# Altium schematic sheet Drawing.SchDoc
size A4; Author: Mikołaj Pichita; CompanyName: AGH University of Science and Technology; SheetNumber: 16; SheetTotal: 16
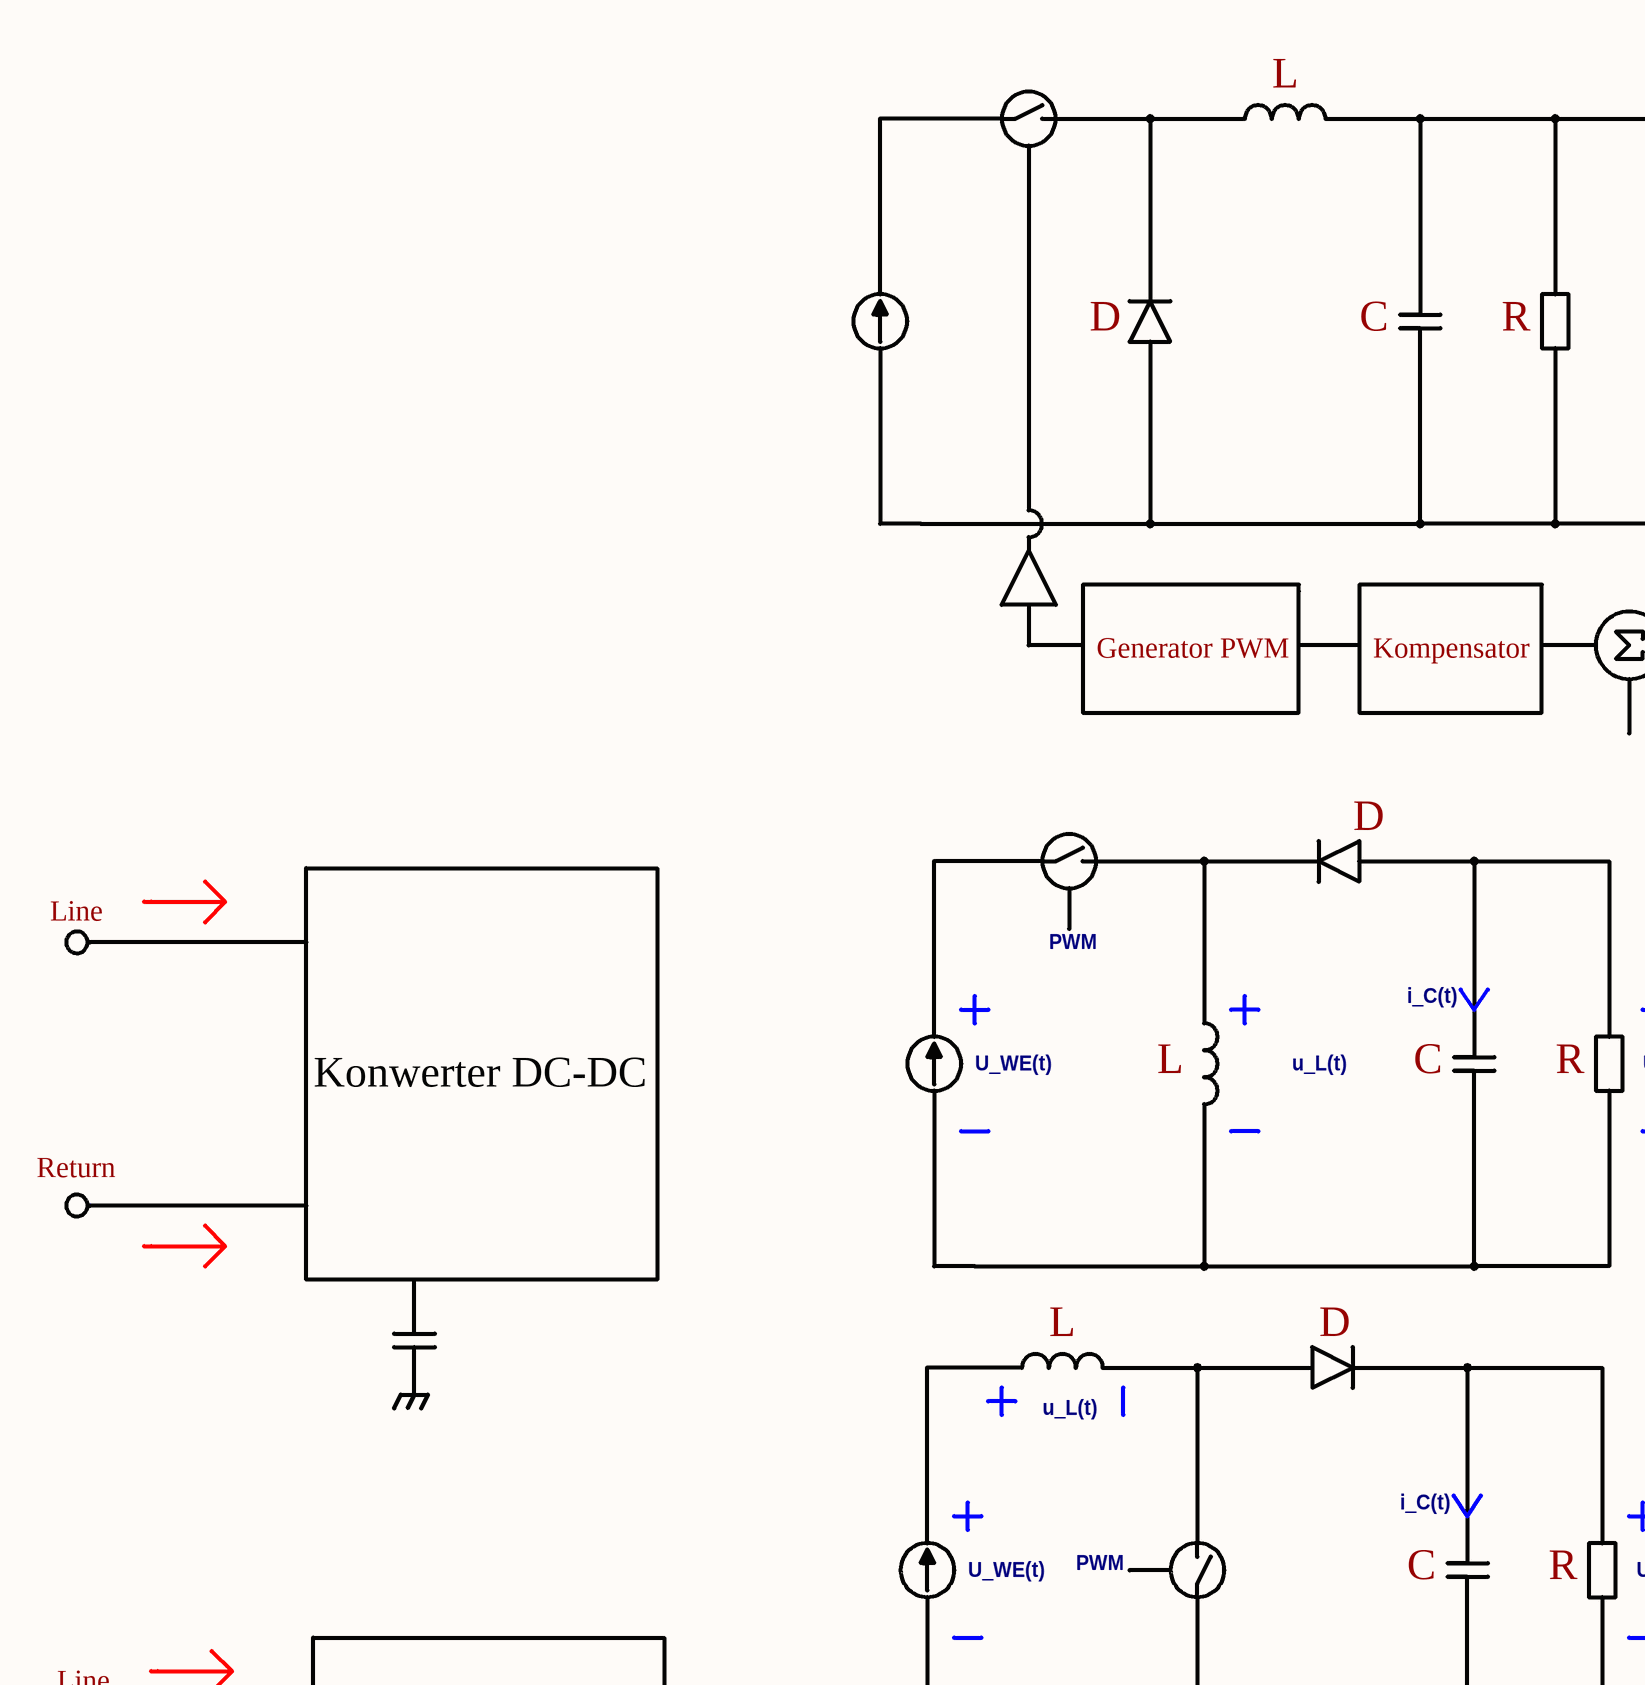
[diagram p0: Drawing.SchDoc, top left]
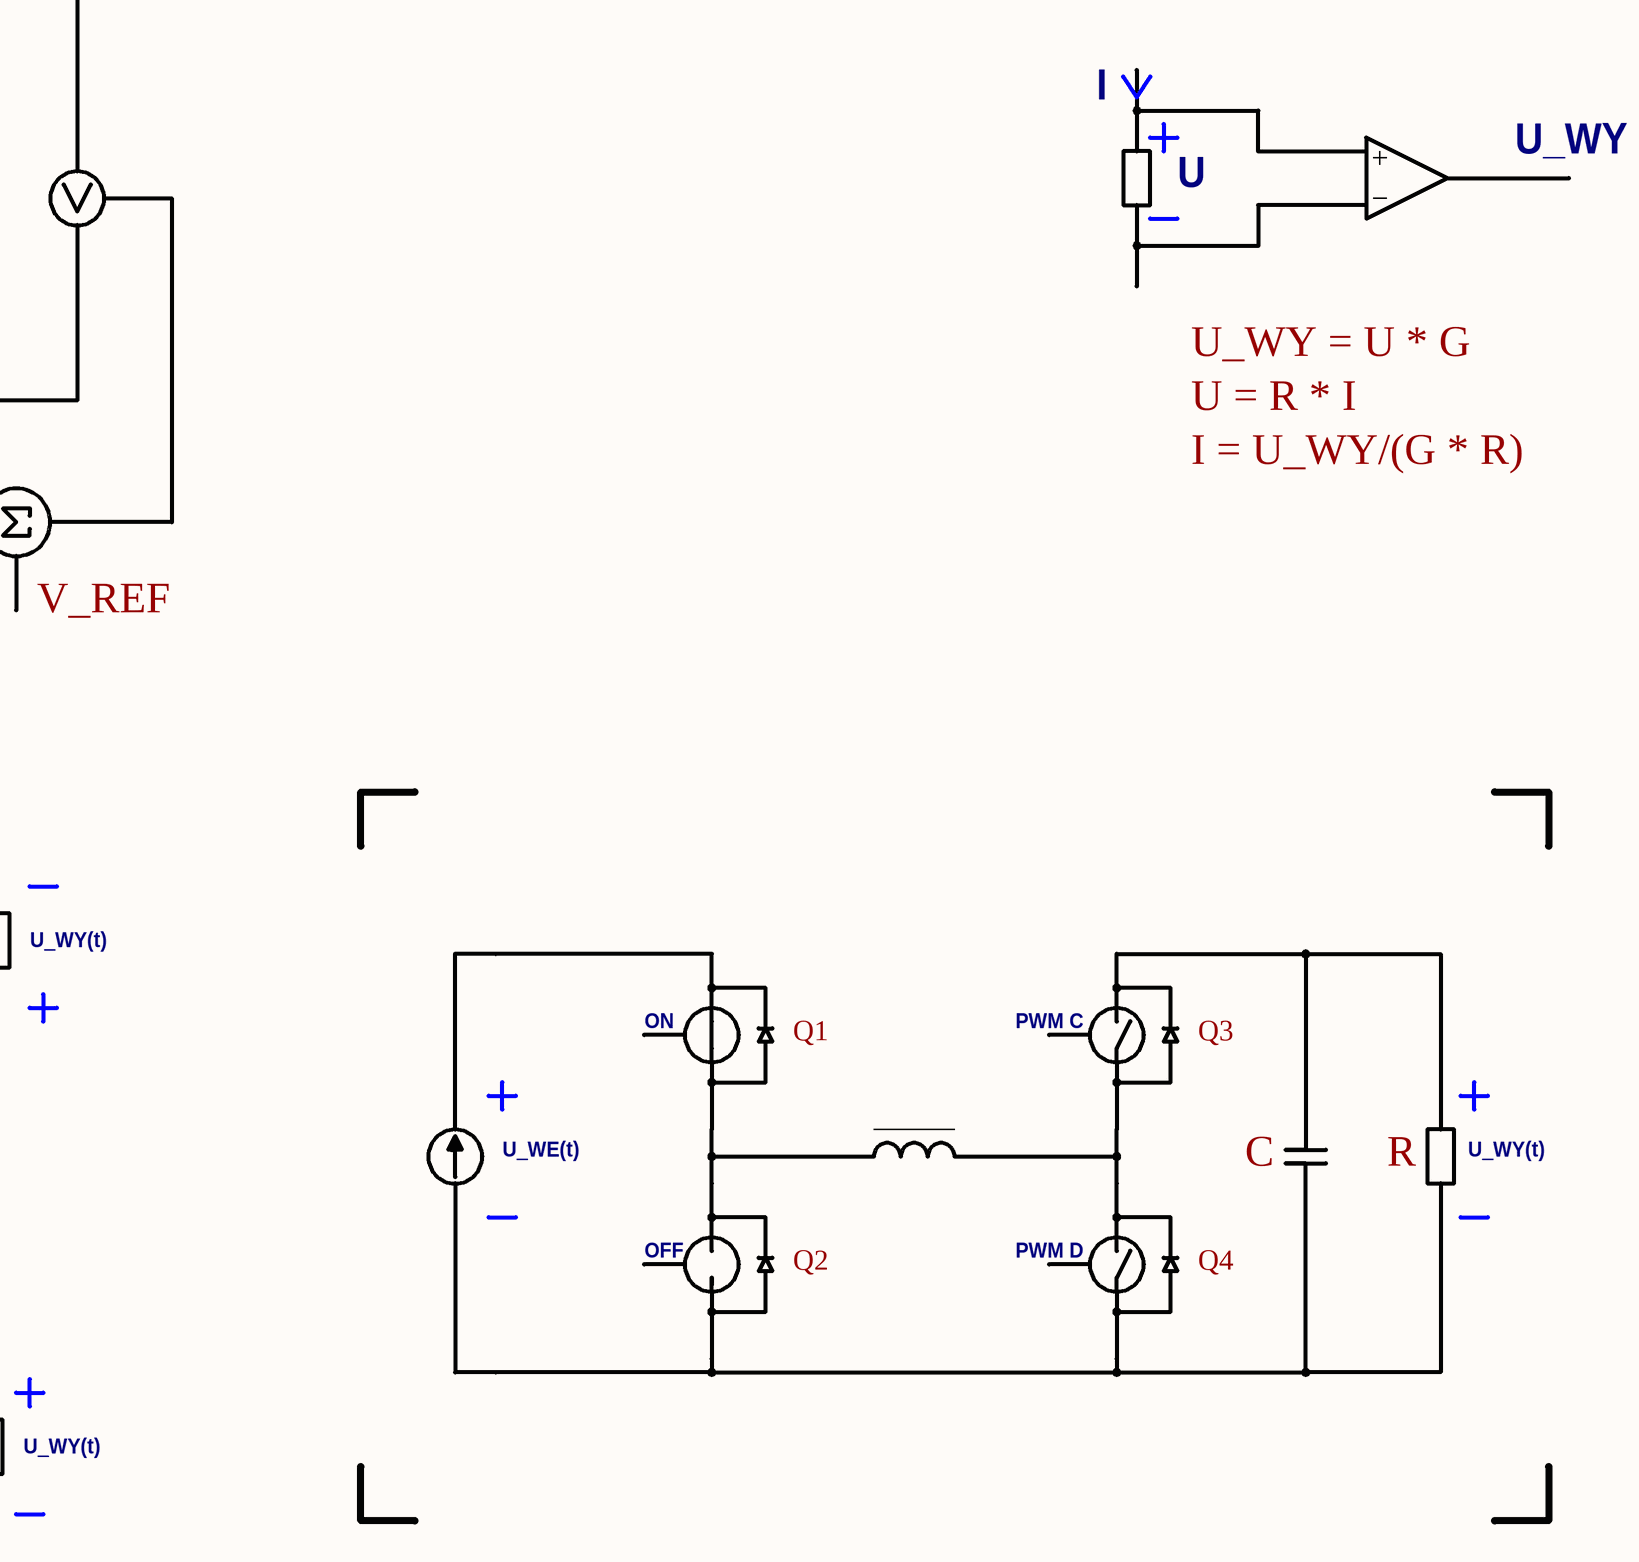
[diagram p1: Drawing.SchDoc, top middle]
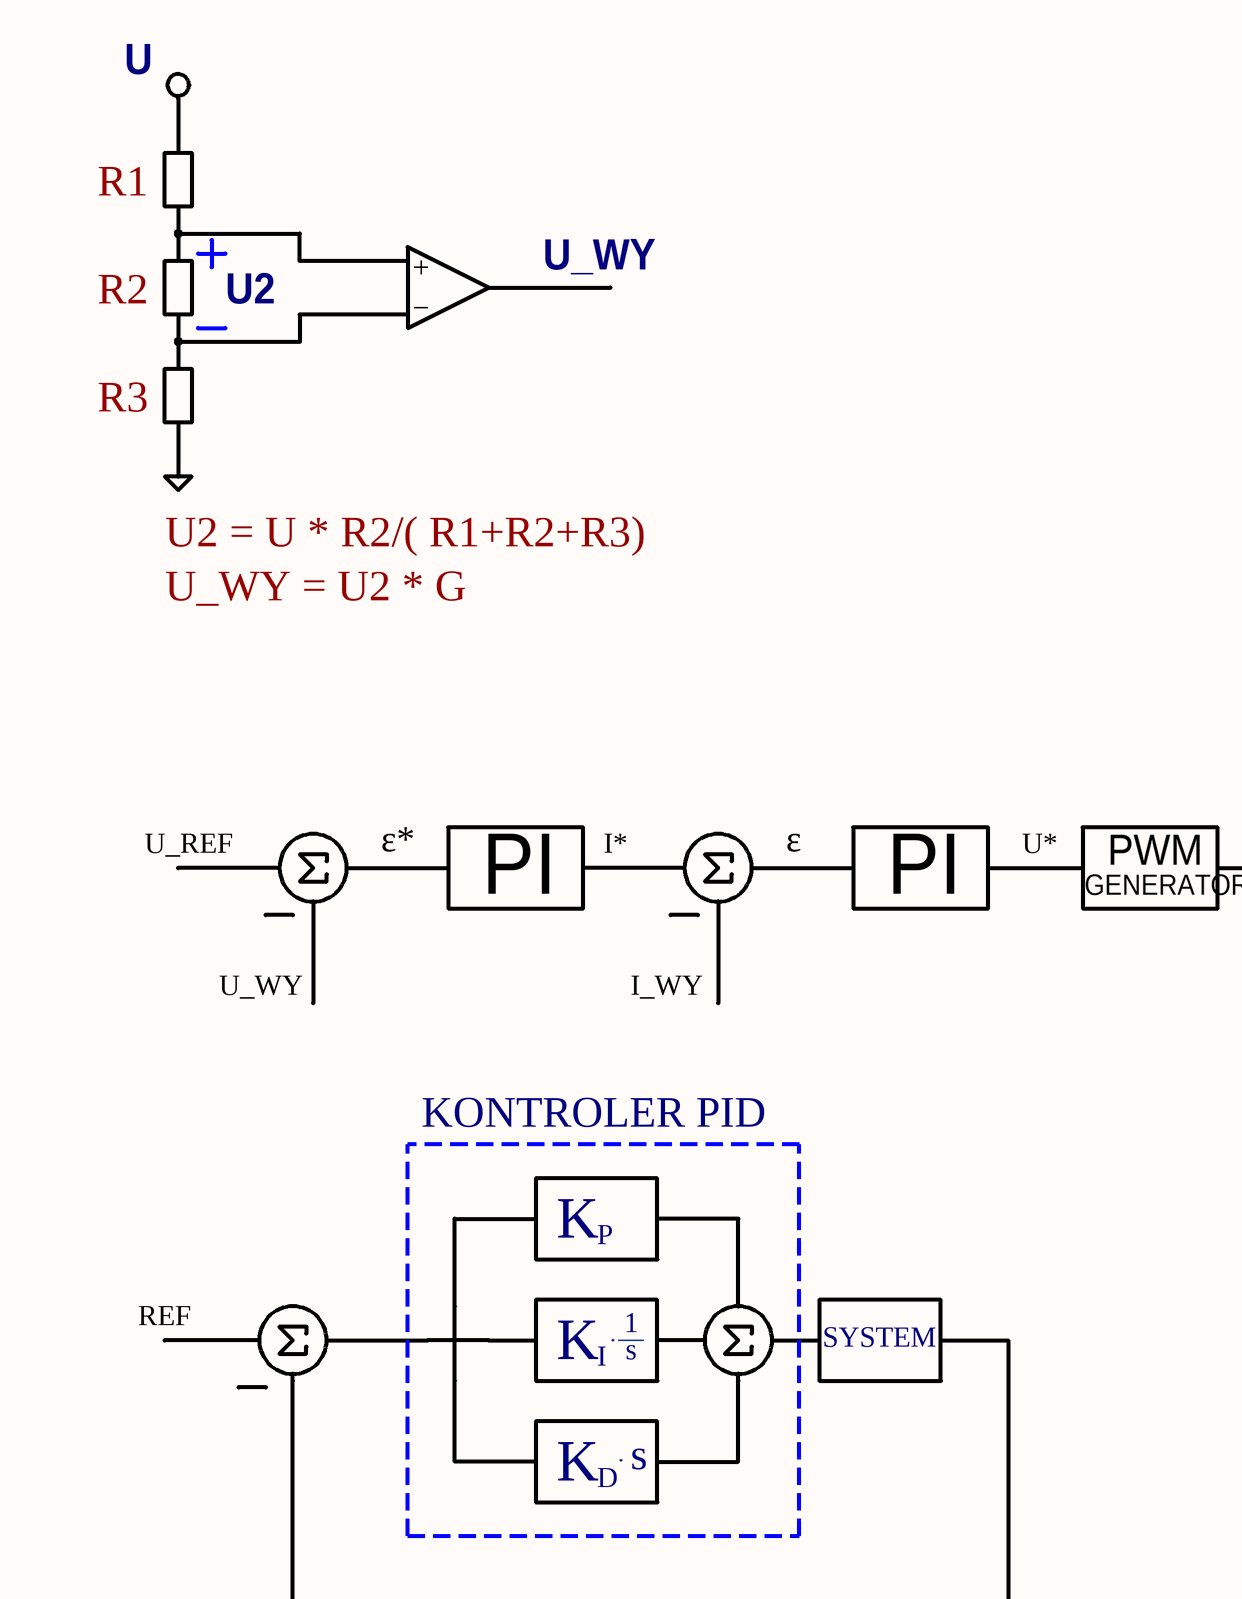
[diagram p2: Drawing.SchDoc, top right]
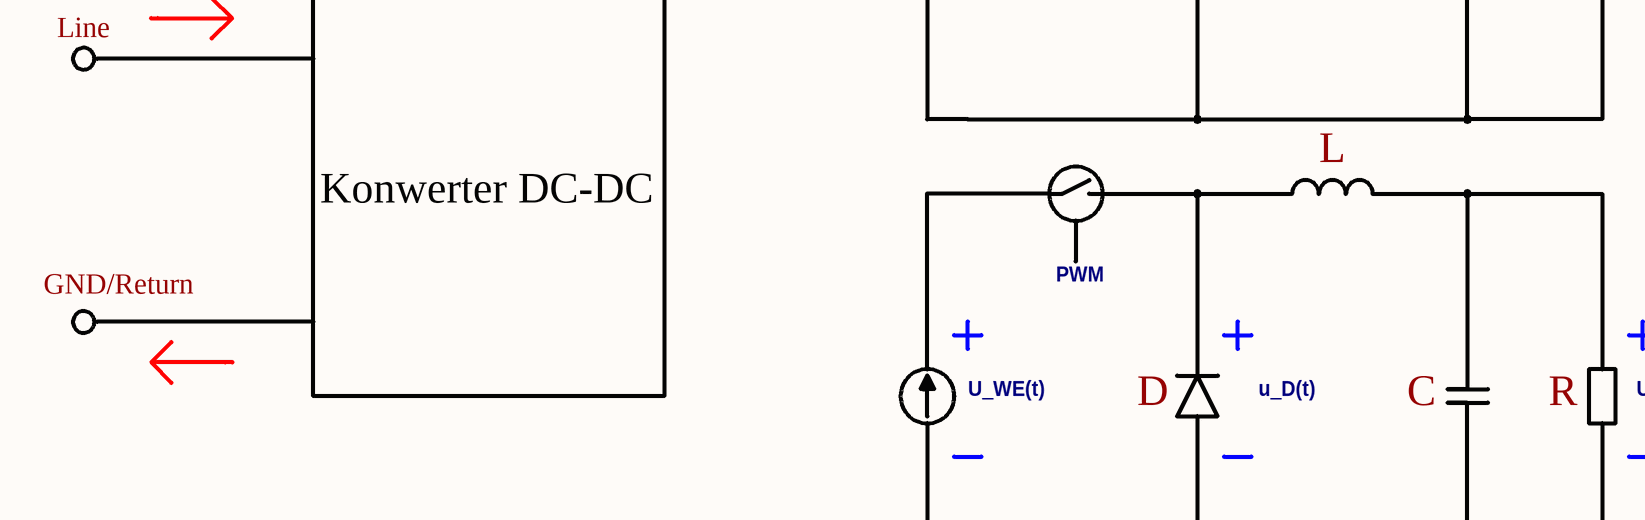
[diagram p3: Drawing.SchDoc, bottom left]
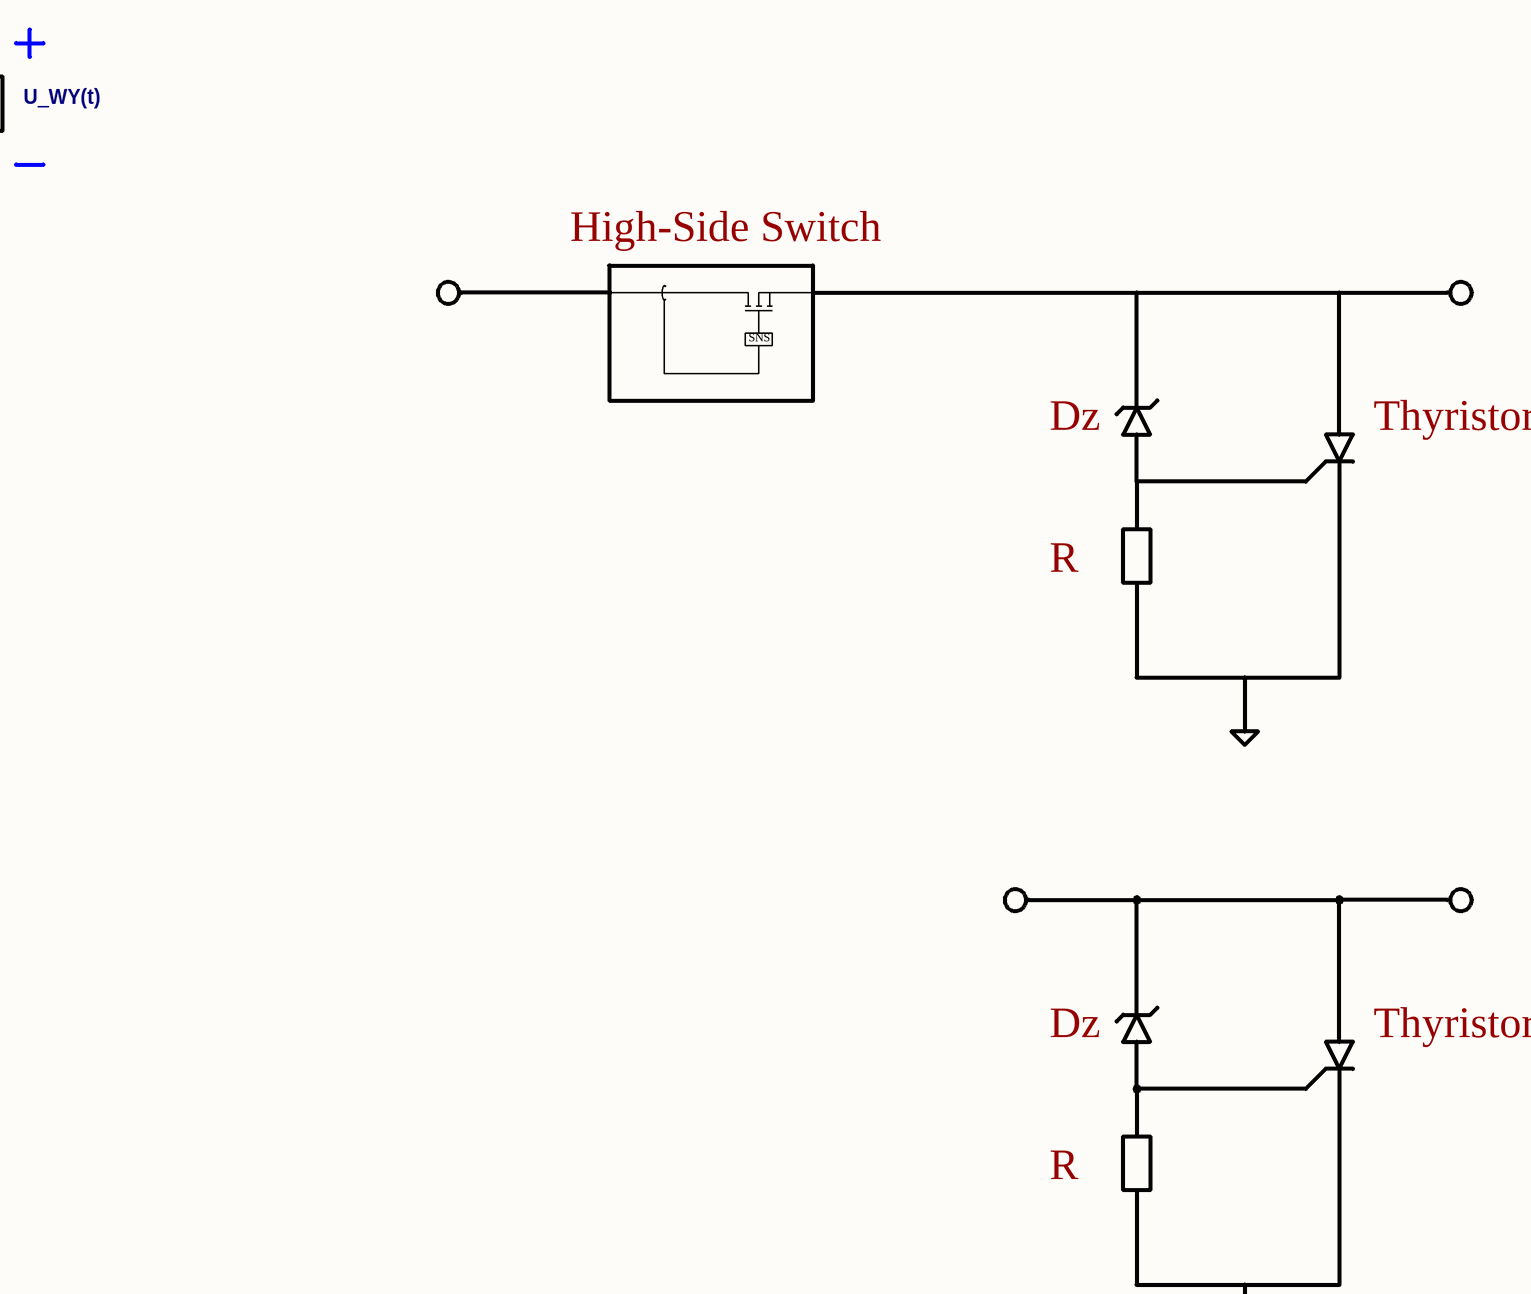
[diagram p4: Drawing.SchDoc, bottom middle]
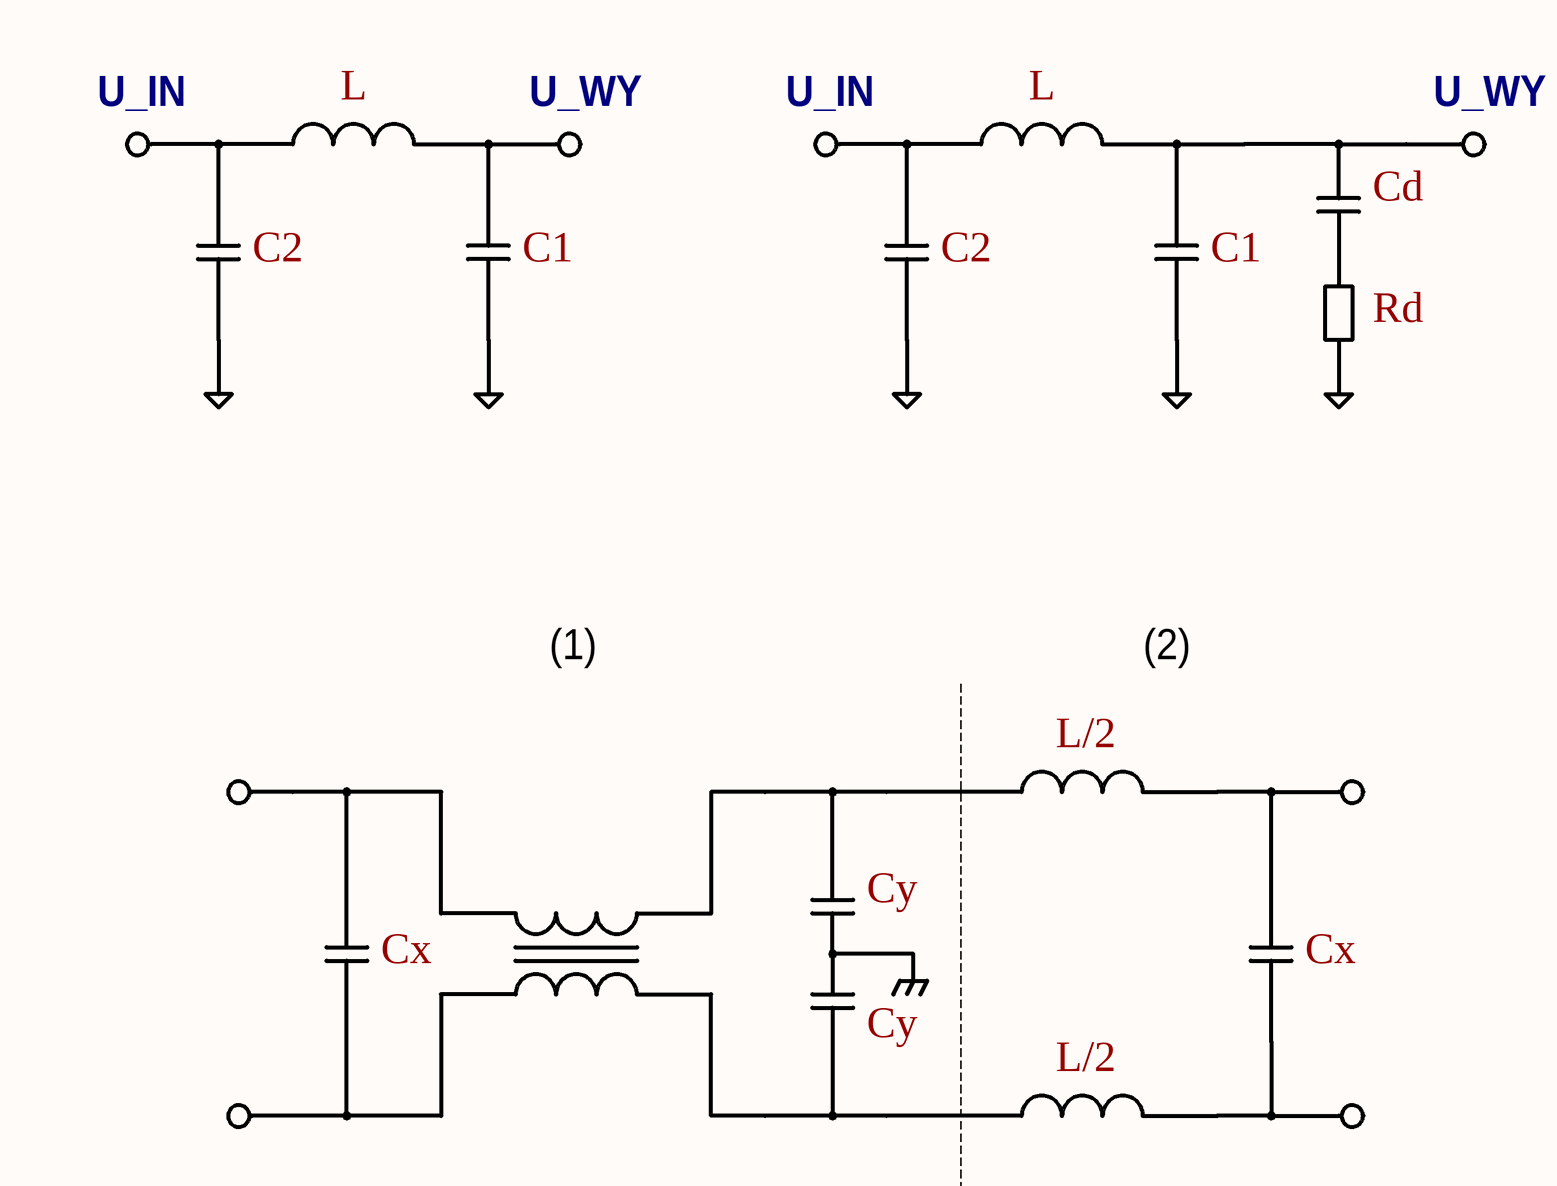
[diagram p5: Drawing.SchDoc, bottom right]

## Notes on the sheet
- L
- U
- I
- R1
- U_WY
- D
- C
- R
- R2
- U2
- R3
- U_WY = U * G
- U = R * I
- U2 = U * R2/( R1+R2+R3)
- I = U_WY/(G * R)
- U_WY = U2 * G
- Generator PWM
- Kompensator
- V_REF
- U_REF
- ε*
- I*
- ε
- U*
- GENERATOR
- PWM
- Line
- PI
- i_C(t)
- I_WY
- Konwerter DC-DC
- U_WE(t)
- u_L(t)
- U_WY(t)
- ON
- Q1
- PWM C
- Q3
- KONTROLER PID
- Return
- K
- P
- REF
- 1
- s
- SYSTEM
- OFF
- Q2
- PWM D
- Q4
- U_IN
- GND/Return
- Cd
- C2
- C1
- u_D(t)
- Rd
- High-Side Switch
- SNS
- Dz
- Thyristor
- (1)
- (2)
- L/2
- Cy
- Cx
- Nazwa projektu
- Nazwa dokumentu
- Nazwa firmy:
- Autor:
- Osoba sprawdzająca:
- Data: